# Altium project Eln1Project.PrjPcb
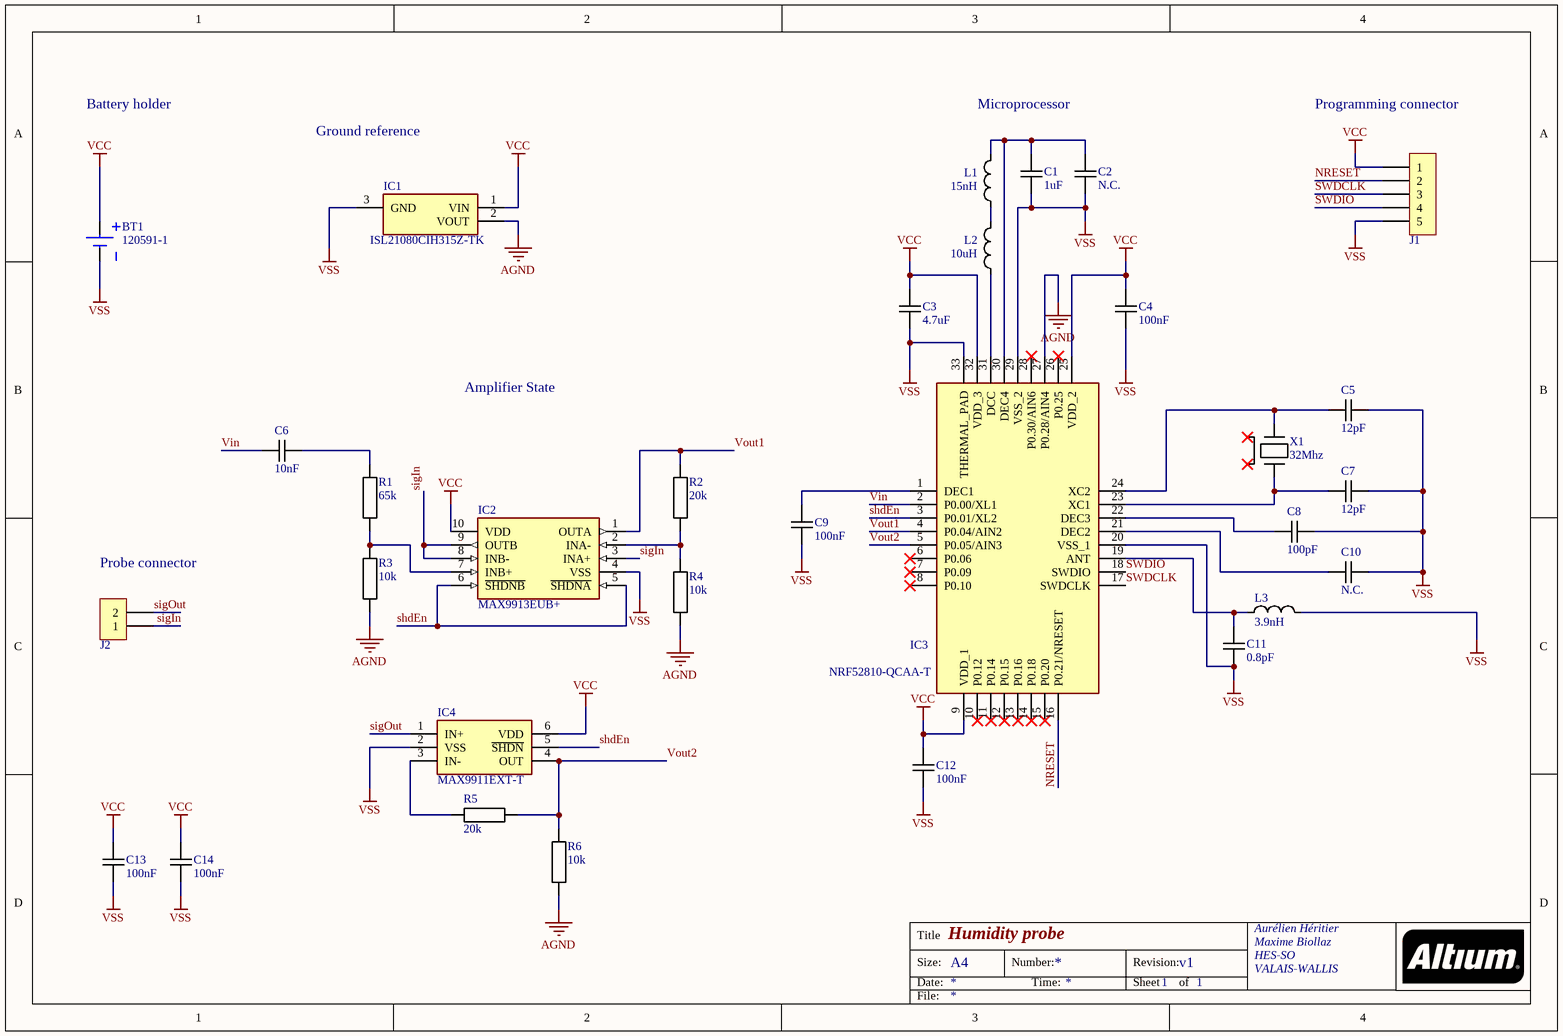
[diagram p0: ELN1project.SchDoc]
PcbDate: 01.06.2020; PcbDesigner: Maxime Biollaz & Aurelien Heritier; PcbRevision: 1.0; SchematicDate: 14.05.2020; SchematicDesigner: Maxime Biollaz & Aurelien Heritier; SchematicRevision: 1.0
1 sheet, 31 parts. Net scope: global (net labels, ports and power ports of the same name join across sheets).
Board file: Eln1Project.PcbDoc

## Sheet ELN1project.SchDoc: Humidity probe
size A4; Date: 1; Organization: Aurélien Héritier; Address1: Maxime Biollaz; Address2: HES-SO; Address3: VALAIS-WALLIS; Revision: v1; SheetNumber: 1; SheetTotal: 1

### Parts
BT1  120591-1  [TECO-120591-1-2_V]
C1  1uF  [CAPACITOR 1005 REFLOW]
C2  N.C.  [CAPACITOR 1005 REFLOW]
C3  4.7uF  [CAPACITOR 1005 REFLOW]
C4  100nF  [CAPACITOR 1005 REFLOW]
C5  12pF  [CAPACITOR 1005 REFLOW]
C6  10nF  [CAPACITOR 1005 REFLOW]
C7  12pF  [CAPACITOR 1005 REFLOW]
C8  100pF  [CAPACITOR 1005 REFLOW]
C9  100nF  [CAPACITOR 1005 REFLOW]
C10  N.C.  [CAPACITOR 1005 REFLOW]
C11  0.8pF  [CAPACITOR 1005 REFLOW]
C12  100nF  [CAPACITOR 1005 REFLOW]
C13  100nF  [CAPACITOR 1005 REFLOW]
C14  100nF  [CAPACITOR 1005 REFLOW]
IC1  ISL21080CIH315Z-TK  [SOT95P237X112-3N]
IC2  MAX9913EUB+  [SOP50P490X110-10N]
IC3  NRF52810-QCAA-T  [QFN50P500X500X80-33N]
IC4  MAX9911EXT-T  [SOT65P218X110-6N]
J1  *  [PinHeader1x5 P1.27]  (value not drawn)
J2  *  [PinHeader1x2 P1.27]  (value not drawn)
L1  15nH  [INDUCTOR 1005 REFLOW]
L2  10uH  [INDUCTOR 1005 REFLOW]
L3  3.9nH  [INDUCTOR 1005 REFLOW]
R1  65k  [RESISTOR 0603 REFLOW]
R2  20k  [RESISTOR 0603 REFLOW]
R3  10k  [RESISTOR 0603 REFLOW]
R4  10k  [RESISTOR 0603 REFLOW]
R5  20k  [RESISTOR 0603 REFLOW]
R6  10k  [RESISTOR 0603 REFLOW]
X1  32Mhz  [Crystal C2.0x1.6 Abracon ABM11W]

### Nets
AGND: IC1.2(VOUT) IC3.27(P0.28/AIN4) R3.1 R4.1 R6.2
VCC: BT1.1(+) C3.2 C4.2 C12.2 C13.2 C14.2 IC1.1(VIN) IC2.10(VDD) IC3.9(VDD_1) IC3.25(VDD_2) IC3.32(VDD_3) IC4.6(VDD) J1.1
VSS: BT1.2(-) C1.1 C2.1 C3.1 C4.1 C5.2 C7.2 C8.2 C9.1 C10.2 C11.1 C12.1 C13.1 C14.1 IC1.3(GND) IC2.4(VSS) IC3.20(VSS_1) IC3.29(VSS_2) IC3.33(THERMAL_PAD) IC4.2(VSS) J1.5 L3.2
NRESET: IC3.16(P0.21/NRESET) J1.2
shdEn: IC2.5(~{SHDNA}) IC2.6(~{SHDNB}) IC3.3(P0.01/XL2) IC4.5(~{SHDN})
sigIn: IC2.3(INA+) IC2.8(INB-) IC2.9(OUTB) J2.1
sigOut: IC4.1(IN+) J2.2
SWDCLK: IC3.17(SWDCLK) J1.3
SWDIO: IC3.18(SWDIO) J1.4
Vin: C6.2 IC3.2(P0.00/XL1)
Vout1: IC2.1(OUTA) IC3.4(P0.04/AIN2) R2.2
Vout2: IC3.5(P0.05/AIN3) IC4.4(OUT) R5.1 R6.1
NetC1_2: C1.2 C2.2 IC3.30(DEC4) L1.2
NetC5_1: C5.1 IC3.24(XC2) X1.1
NetC6_1: C6.1 R1.2
NetC7_1: C7.1 IC3.23(XC1) X1.3
NetC8_1: C8.1 IC3.22(DEC3)
NetC9_2: C9.2 IC3.1(DEC1)
NetC10_1: C10.1 IC3.21(DEC2)
NetC11_2: C11.2 IC3.19(ANT) L3.1
NetIC2_2: IC2.2(INA-) R2.1 R4.2
NetIC2_7: IC2.7(INB+) R1.1 R3.2
NetIC3_31: IC3.31(DCC) L2.1
NetIC4_3: IC4.3(IN-) R5.2
NetL1_1: L1.1 L2.2

Not connected (* = marked no-connect by the designer): IC3 6(P0.06)* 7(P0.09)* 8(P0.10)* 10(P0.12)* 11(P0.14)* 12(P0.15)* 13(P0.16)* 14(P0.18)* 15(P0.20)* 26(P0.25)* 28(P0.30/AIN6)*; X1 2* 4*

### Notes on the sheet
- Battery holder
- Microprocessor
- Programming connector
- Ground reference
- Amplifier State
- (near J2) Probe connector
- Title
- Size:
- Date:
- A4
- Number:
- Time:
- Revision:
- Sheet
- of
- File:

### Library data of the parts
BT1 = 120591-1: Lithium Battery Holder for CR2032 3V Cell; Manufacturer: TE Connectivity; ItemHRID: CMP-0438-00001; RevisionId: 1; Packing Type: Tray; Folder: Unified Components\Components\TE Connectivity\Connectors & Connector Components\Power Products\Battery Interconnection Products\; Body Shape: Horizontal Cylindrical; ContentType: Unified Component; AccessRights: 2147483647; PartNumber: 120591-1; ComponentLink1Description: Manufacturer URL; ComponentLink2Description: Datasheet; DatasheetVersion: Rev. H, 01/2013; ComponentLink1URL: http://www.te.com/; LifeCycleStateGUID: 61E382EE-6656-4F12-9E24-BE9327104A25; ReleaseDate: 20/08/2013 02:50:22 AM; ContentTypeGUID: CB3C11C4-E317-11DF-B822-12313F0024A2; ComponentLink2URL: http://www.te.com/commerce/DocumentDelivery/DDEController?Action=showdoc&DocId=Customer+Drawing%7F120591%7FH%7Fpdf%7FEnglish%7FENG_CD_120591_H.pdf%7F120591-1; LifeCycle: Released; FolderGUID: A6761B51-D489-48A3-9180-F4808F45AB79; ItemGUID: B2C50140-681E-4F62-8DBB-9728605318CE; Mounting Technology: Through Hole; PackageReference: 120591-1; PackageDescription: Lithium Battery Holder
C1-C14 = Capacitor
  C1: Value: 1uF
  C2 C10: Value: N.C.
  C3: Value: 4.7uF
  C4 C9 C12-C14: Value: 100nF
  C5 C7: Value: 12pF
  C6: Value: 10nF
  C8: Value: 100pF
  C11: Value: 0.8pF
IC1 = ISL21080CIH315Z-TK: Integrated Circuit; Manufacturer_Name: Renesas Electronics; Datasheet Link: https://www.renesas.com/en-us/www/doc/datasheet/isl21080.pdf; Height: 1.12mm; Manufacturer_Part_Number: ISL21080CIH315Z-TK; Mouser Part Number: 968-ISL21080CIH315ZT; Mouser Price/Stock: http://www.mouser.com/Search/ProductDetail.aspx?qs=9fLuogzTs8LxZWNzls3EKw%3d%3d
IC2 = MAX9913EUB+: Integrated Circuit; Manufacturer_Name: Maxim Integrated; Datasheet Link: https://altium.componentsearchengine.com/Datasheets/1/MAX9913EUB+.pdf; Height: 1.1mm; Manufacturer_Part_Number: MAX9913EUB+
IC3 = NRF52810-QCAA-T: Integrated Circuit; Manufacturer_Name: Nordic Semiconductor; Datasheet Link: https://componentsearchengine.com/Datasheets/1/nRF52810-QCAA-T.pdf; Height: 0.8mm; Manufacturer_Part_Number: NRF52810-QCAA-T; Mouser Part Number: 949-NRF52810-QCAA-T; Mouser Price/Stock: https://www.mouser.co.uk/ProductDetail/Nordic-Semiconductor/nRF52810-QCAA-T?qs=5aG0NVq1C4ykfpvypn%2FnAA%3D%3D; RS Part Number: 1697120P; RS Price/Stock: http://uk.rs-online.com/web/p/products/1697120P
IC4 = MAX9911EXT-T: Integrated Circuit; Manufacturer_Name: Maxim Integrated; Datasheet Link: https://datasheets.maximintegrated.com/en/ds/MAX9910-MAX9913.pdf; Height: 1.1mm; Manufacturer_Part_Number: MAX9911EXT-T
J1 = PinHeader1x5: Plug connector; Value: *
J2 = PinHeader1x2: Plug connector; Value: *
L1-L3 = Inductor
  L1: Value: 15nH
  L2: Value: 10uH
  L3: Value: 3.9nH
R1-R6 = Resistor
  R1: Value: 65k
  R2 R5: Value: 20k
  R3 R4 R6: Value: 10k
X1 = Crystal C2.0x1.6 Abracon ABM11W: Value: 32Mhz